# EAGLE schematic Schematic (EAGLE 9.6.2)
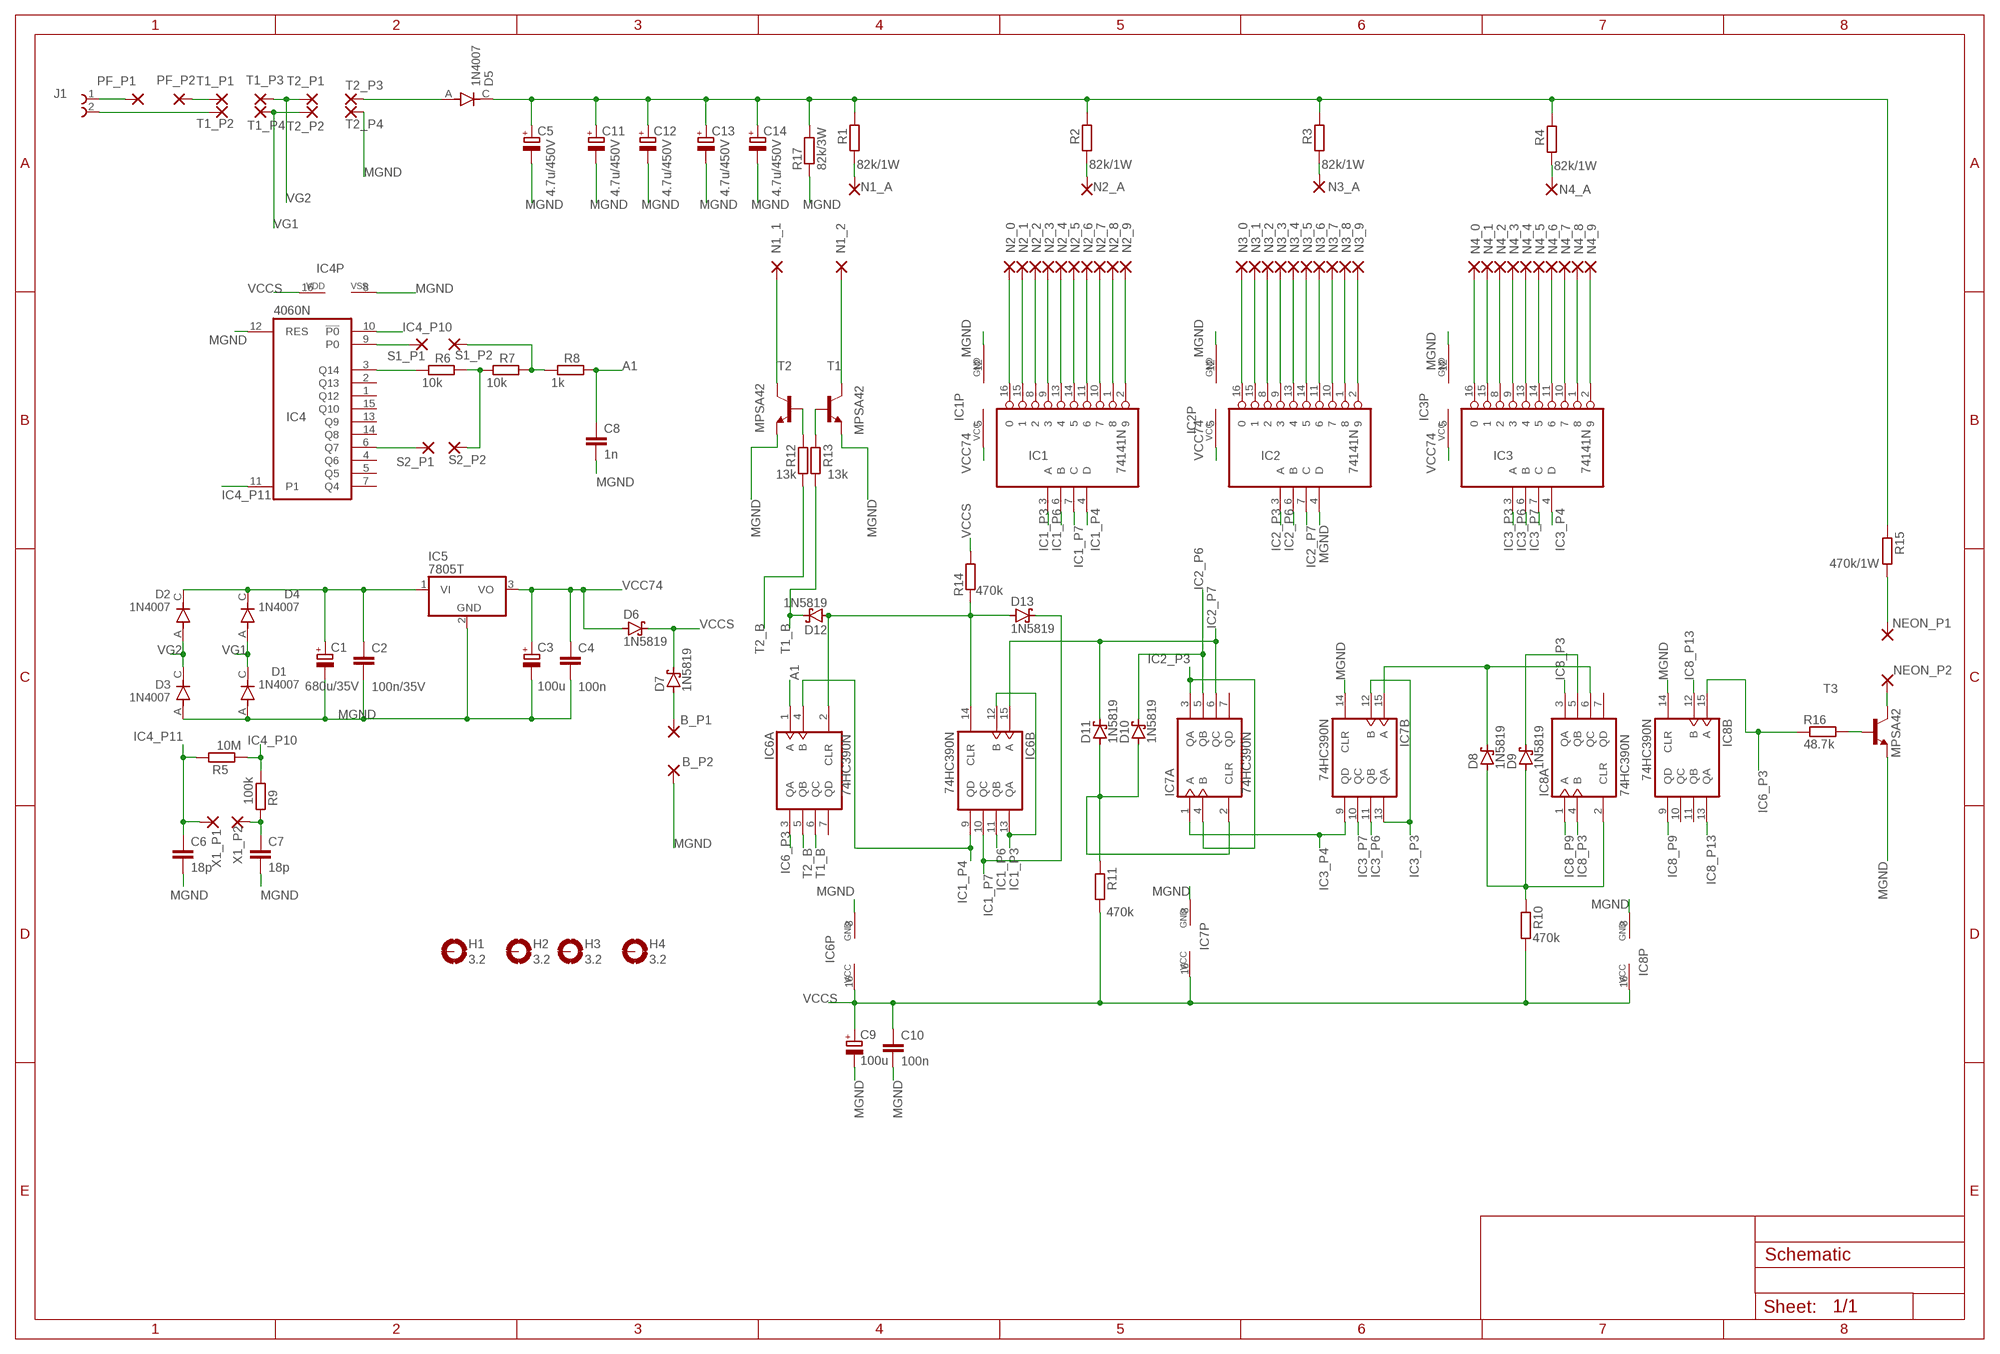
[diagram p0: schematic, sheet 1]

## Parts
B_P1  3,81/1,4  [3,81/1,4]
B_P2  3,81/1,4  [3,81/1,4]
C1  680u/35V  CPOL-EUE5-10.5  [E5-10,5]
C2  100n/35V  C-EU025-024X044  [C025-024X044]
C3  100u  CPOL-EUE2-4  [E2-4]
C4  100n  C-EU025-024X044  [C025-024X044]
C5  4.7u/450V  CPOL-EUE5-8.5  [E5-8,5]
C6  18p  C-EU025-024X044  [C025-024X044]
C7  18p  C-EU025-024X044  [C025-024X044]
C8  1n  C-EU025-024X044  [C025-024X044]
C9  100u  CPOL-EUE2-4  [E2-4]
C10  100n  C-EU025-024X044  [C025-024X044]
C11  4.7u/450V  CPOL-EUE5-8.5  [E5-8,5]
C12  4.7u/450V  CPOL-EUE5-8.5  [E5-8,5]
C13  4.7u/450V  CPOL-EUE5-8.5  [E5-8,5]
C14  4.7u/450V  CPOL-EUE5-8.5  [E5-8,5]
D1  1N4007  [DIOAD1060W80L520D270]
D2  1N4007  [DIOAD1060W80L520D270]
D3  1N4007  [DIOAD1060W80L520D270]
D4  1N4007  [DIOAD1060W80L520D270]
D5  1N4007  [DIOAD1060W80L520D270]
D6  1N5819  1N5819-B  [DO41-7.6]
D7  1N5819  1N5819-B  [DO41-7.6]
D8  1N5819  1N5819-B  [DO41-7.6]
D9  1N5819  1N5819-B  [DO41-7.6]
D10  1N5819  1N5819-B  [DO41-7.6]
D11  1N5819  1N5819-B  [DO41-7.6]
D12  1N5819  1N5819-B  [DO41-7.6]
D13  1N5819  1N5819-B  [DO41-7.6]
H1  3.2  MOUNT-PAD-ROUND3.2  [3,2-PAD]
H2  3.2  MOUNT-PAD-ROUND3.2  [3,2-PAD]
H3  3.2  MOUNT-PAD-ROUND3.2  [3,2-PAD]
H4  3.2  MOUNT-PAD-ROUND3.2  [3,2-PAD]
IC1  74141N  [DIL16]
IC2  74141N  [DIL16]
IC3  74141N  [DIL16]
IC4  4060N  [DIL16]
IC5  7805T  [TO220H]
IC6  74HC390N  [DIL16]
IC7  74HC390N  [DIL16]
IC8  74HC390N  [DIL16]
J1  691216910002  [691216910002]
N1_1  3,81/1,4  [3,81/1,4]
N1_2  3,81/1,4  [3,81/1,4]
N1_A  3,81/1,4  [3,81/1,4]
N2_0  3,81/1,4  [3,81/1,4]
N2_1  3,81/1,4  [3,81/1,4]
N2_2  3,81/1,4  [3,81/1,4]
N2_3  3,81/1,4  [3,81/1,4]
N2_4  3,81/1,4  [3,81/1,4]
N2_5  3,81/1,4  [3,81/1,4]
N2_6  3,81/1,4  [3,81/1,4]
N2_7  3,81/1,4  [3,81/1,4]
N2_8  3,81/1,4  [3,81/1,4]
N2_9  3,81/1,4  [3,81/1,4]
N2_A  3,81/1,4  [3,81/1,4]
N3_0  3,81/1,4  [3,81/1,4]
N3_1  3,81/1,4  [3,81/1,4]
N3_2  3,81/1,4  [3,81/1,4]
N3_3  3,81/1,4  [3,81/1,4]
N3_4  3,81/1,4  [3,81/1,4]
N3_5  3,81/1,4  [3,81/1,4]
N3_6  3,81/1,4  [3,81/1,4]
N3_7  3,81/1,4  [3,81/1,4]
N3_8  3,81/1,4  [3,81/1,4]
N3_9  3,81/1,4  [3,81/1,4]
N3_A  3,81/1,4  [3,81/1,4]
N4_0  3,81/1,4  [3,81/1,4]
N4_1  3,81/1,4  [3,81/1,4]
N4_2  3,81/1,4  [3,81/1,4]
N4_3  3,81/1,4  [3,81/1,4]
N4_4  3,81/1,4  [3,81/1,4]
N4_5  3,81/1,4  [3,81/1,4]
N4_6  3,81/1,4  [3,81/1,4]
N4_7  3,81/1,4  [3,81/1,4]
N4_8  3,81/1,4  [3,81/1,4]
N4_9  3,81/1,4  [3,81/1,4]
N4_A  3,81/1,4  [3,81/1,4]
NEON_P1  3,81/1,4  [3,81/1,4]
NEON_P2  3,81/1,4  [3,81/1,4]
PF_P1  3,81/1,4  [3,81/1,4]
PF_P2  3,81/1,4  [3,81/1,4]
R1  82k/1W  R-EU_0207/10  [0207/10]
R2  82k/1W  R-EU_0207/10  [0207/10]
R3  82k/1W  R-EU_0207/10  [0207/10]
R4  82k/1W  R-EU_0207/10  [0207/10]
R5  10M  R-EU_0207/10  [0207/10]
R6  10k  R-EU_0207/10  [0207/10]
R7  10k  R-EU_0207/10  [0207/10]
R8  1k  R-EU_0207/10  [0207/10]
R9  100k  R-EU_0207/10  [0207/10]
R10  470k  R-EU_0207/10  [0207/10]
R11  470k  R-EU_0207/10  [0207/10]
R12  13k  R-EU_0207/10  [0207/10]
R13  13k  R-EU_0207/10  [0207/10]
R14  470k  R-EU_0207/10  [0207/10]
R15  470k/1W  R-EU_0207/10  [0207/10]
R16  48.7k  R-EU_0207/10  [0207/10]
R17  82k/3W  R-EU_0411/12  [0411/12]
S1_P1  3,81/1,4  [3,81/1,4]
S1_P2  3,81/1,4  [3,81/1,4]
S2_P1  3,81/1,4  [3,81/1,4]
S2_P2  3,81/1,4  [3,81/1,4]
T1  MPSA42  MPSA06-NPN-TO92-EBC  [TO92-EBC]
T1_P1  3,81/1,4  [3,81/1,4]
T1_P2  3,81/1,4  [3,81/1,4]
T1_P3  3,81/1,4  [3,81/1,4]
T1_P4  3,81/1,4  [3,81/1,4]
T2  MPSA42  MPSA06-NPN-TO92-EBC  [TO92-EBC]
T2_P1  3,81/1,4  [3,81/1,4]
T2_P2  3,81/1,4  [3,81/1,4]
T2_P3  3,81/1,4  [3,81/1,4]
T2_P4  3,81/1,4  [3,81/1,4]
T3  MPSA42  MPSA06-NPN-TO92-EBC  [TO92-EBC]
X1_P1  1,6/0,8  [1,6/0,8]
X1_P2  1,6/0,8  [1,6/0,8]

## Nets
0_1: IC1.16 N2_0.1(P)
0_2: IC2.16 N3_0.1(P)
0_3: IC3.16 N4_0.1(P)
A1: C8.1 IC6.1(A:A) R8.2
IC1_P3: IC1.3(A) IC6.12(B:B) IC6.13(B:QA)
IC1_P4: IC1.4(D) IC6.4(A:B) IC6.9(B:QD)
IC1_P6: IC1.6(B) IC6.11(B:QB)
IC1_P7: D13.C IC1.7(C) IC6.10(B:QC)
IC2_P3: IC2.3(A) IC7.3(A:QA) IC7.4(A:B)
IC2_P6: D10.C IC2.6(B) IC7.5(A:QB)
IC2_P7: D11.C IC2.7(C) IC6.15(B:A) IC7.6(A:QC)
IC3_P3: IC3.3(A) IC7.12(B:B) IC7.13(B:QA)
IC3_P4: IC3.4(D) IC7.1(A:A) IC7.9(B:QD)
IC3_P6: IC3.6(B) IC7.11(B:QB)
IC3_P7: IC3.7(C) IC7.10(B:QC)
IC4_P10: IC4.10(!P0) R5.1 R9.1
IC4_P11: C6.1 IC4.11(P1) R5.2 X1_P1.1(P)
IC6_P3: IC6.3(A:QA) IC8.15(B:A) R16.1
IC8_P3: IC8.3(A:QA) IC8.4(A:B)
IC8_P9: IC8.1(A:A) IC8.9(B:QD)
IC8_P13: IC8.12(B:B) IC8.13(B:QA)
MGND: B_P2.1(P) C1.- C2.2 C3.- C4.2 C5.- C6.2 C7.2 C8.2 C9.- C10.2 C11.- C12.- C13.- C14.- D1.A D3.A IC1.12(GND) IC2.4(D) IC2.12(GND) IC3.12(GND) IC4.8(VSS) IC4.12(RES) IC5.2(GND) IC6.8(P:GND) IC7.8(P:GND) IC7.14(B:CLR) IC8.8(P:GND) IC8.14(B:CLR) R17.1 T1.E T2.E T2_P4.1(P) T3.E
N$1 [HV]: J1.1 PF_P1.1(P)
N$2 [HV]: J1.2 T1_P2.1(P)
N$3 [HV]: D5.A T2_P3.1(P)
N$4 [HV]: C5.+ C11.+ C12.+ C13.+ C14.+ D5.C R1.2 R2.2 R3.2 R4.2 R15.1 R17.2
N$5 [HV]: N2_A.1(P) R2.1
N$6 [HV]: N3_A.1(P) R3.1
N$7 [HV]: N4_A.1(P) R4.1
N$8 [HV]: N1_A.1(P) R1.1
N$9: IC4.9(P0) S1_P1.1(P)
N$10: IC4.6(Q7) S2_P1.1(P)
N$11: IC4.3(Q14) R6.1
N$12: R6.2 R7.1 S2_P2.1(P)
N$13: R7.2 R8.1 S1_P2.1(P)
N$14: D12.A D13.A IC6.2(A:CLR) IC6.14(B:CLR) R14.1
N$15: IC1.15 N2_1.1(P)
N$16: C1.+ C2.1 D2.C D4.C IC5.1(VI)
N$17: B_P1.1(P) D7.A
N$18: IC1.8 N2_2.1(P)
N$19: IC1.9 N2_3.1(P)
N$20: IC1.13 N2_4.1(P)
N$21: IC1.14 N2_5.1(P)
N$22: IC1.11 N2_6.1(P)
N$23: IC1.10 N2_7.1(P)
N$24: IC1.1 N2_8.1(P)
N$25: IC1.2 N2_9.1(P)
N$26: IC2.15 N3_1.1(P)
N$27: IC2.8 N3_2.1(P)
N$28: IC2.9 N3_3.1(P)
N$29: IC2.13 N3_4.1(P)
N$30: IC2.14 N3_5.1(P)
N$31: IC2.11 N3_6.1(P)
N$32: IC2.10 N3_7.1(P)
N$33: IC2.1 N3_8.1(P)
N$34: IC2.2 N3_9.1(P)
N$35: IC3.15 N4_1.1(P)
N$36: IC3.8 N4_2.1(P)
N$37: IC3.9 N4_3.1(P)
N$38: IC3.13 N4_4.1(P)
N$39: IC3.14 N4_5.1(P)
N$40: IC3.11 N4_6.1(P)
N$41: IC3.10 N4_7.1(P)
N$42: IC3.1 N4_8.1(P)
N$43: IC3.2 N4_9.1(P)
N$44: C7.1 R9.2 X1_P2.1(P)
N$45: R13.2 T2.B
N$46: D8.A D9.A IC8.2(A:CLR) R10.1
N$47: D8.C IC7.15(B:A) IC8.6(A:QC)
N$48: D9.C IC8.5(A:QB)
N$49: D10.A D11.A IC7.2(A:CLR) R11.1
N$50: N1_1.1(P) T1.C
N$51: N1_2.1(P) T2.C
N$52 [HV]: NEON_P1.1(P) R15.2
N$53 [HV]: NEON_P2.1(P) T3.C
N$54: R16.2 T3.B
N$55: R12.2 T1.B
N$56 [HV]: PF_P2.1(P) T1_P1.1(P)
T1_B: D12.C IC6.6(A:QC) R13.1
T2_B: IC6.5(A:QB) R12.1
VCC74: C3.+ C4.1 D6.A IC1.5(VCC) IC2.5(VCC) IC3.5(VCC) IC5.3(VO)
VCCS: C9.+ C10.1 D6.C D7.C IC4.16(VDD) IC6.16(P:VCC) IC7.16(P:VCC) IC8.16(P:VCC) R10.2 R11.2 R14.2
VG1 [HV]: D1.C D4.A T1_P4.1(P) T2_P2.1(P)
VG2 [HV]: D2.A D3.C T1_P3.1(P) T2_P1.1(P)
Unconnected: H1.B3,2(MOUNT) H2.B3,2(MOUNT) H3.B3,2(MOUNT) H4.B3,2(MOUNT) IC4.1(Q12) IC4.2(Q13) IC4.4(Q6) IC4.5(Q5) IC4.7(Q4) IC4.13(Q9) IC4.14(Q8) IC4.15(Q10) IC6.7(A:QD) IC7.7(A:QD) IC8.7(A:QD) IC8.10(B:QC) IC8.11(B:QB)

## Library data of the parts
B_P1 B_P2 N1_1 N1_2 N1_A N2_0 N2_1-N2_9 N2_A N3_0 N3_1-N3_9 N3_A N4_0 N4_1-N4_9 N4_A NEON_P1 NEON_P2 PF_P1 PF_P2 S1_P1 S1_P2 S2_P1 S2_P2 T1_P1-T1_P4 T2_P1-T2_P4 = wirepad:3,81/1,4: THROUGH-HOLE PAD
C1 C3 C5 C9 C11-C14 = rcl:CPOL-EU: POLARIZED CAPACITOR, European symbol; SPICEPREFIX: C
C2 C4 C6-C8 C10 = rcl:C-EU: CAPACITOR, European symbol; SPICEPREFIX: C
D1-D5 = 1N4007:1N4007: Diode Switching 1KV 1A 2-Pin DO-41 Check availability <https://pricing.snapeda.com/parts/1N4007/Diotec%20Semiconductor/view-part?ref=eda>; AVAILABILITY: In Stock; DESCRIPTION: Diode Standard 1000 V 1A Through Hole DO-41/DO-204AC; MF: Diotec Semiconductor; MP: 1N4007; PACKAGE: DO-41-2 Diotec; PRICE: None; PURCHASE-URL: https://pricing.snapeda.com/search/part/1N4007/?ref=eda
D6-D13 = diode:1N581*: 1.0A SCHOTTKY BARRIER RECTIFIER Source: http://www.diodes.com/datasheets/ds23001.pdf
H1-H4 = holes:MOUNT-PAD-ROUND: MOUNTING PAD, round
IC1-IC3 = 74xx-us:74*141: BCD to decimal DECODER/DRIVER
IC4 = 40xx:4060: 14-stage binary/ripple COUNTER
IC5 = linear:78*: Positive VOLTAGE REGULATOR Source: http://cache.national.com/ds/LM/LM78L05.pdf http://www.fairchildsemi.com/ds/LM/LM7805.pdf
IC6-IC8 = 74xx-eu:74*390: Dual 4-bit decade and binary COUNTER
J1 = ak750:691216910002: WR-TBL2 SERIE 2169 - 7.50 MM - HORIZONTAL CABLE ENTRY WITH RISING CAGE CLAMP - 2 pins <http://katalog.we-online.de/media/thumbs2/eican/thb_Con_TBL_Screw_RisingClamp_7.50_6912169100xx_pf2.jpg> Details see: http://katalog.we-online.de/en/em/TBL_7_50_2169_HORIZONTAL_ENTRY_MODULAR_69121691000x Created on 2015-07-10 2015 (C) Wurth Elektronik Check availability <https://pricing.snapeda.com/parts/691216910002/Wurth%20Electronics/view-part?ref=eda>; AVAILABILITY: In Stock; DESCRIPTION: 2 Position Wire to Board Terminal Block Horizontal with Board 0.295 (7.50mm) Through Hole; MF: Wurth Electronics; MP: 691216910002; PACKAGE: None; PRICE: None
R1-R17 = rcl:R-EU_: RESISTOR, European symbol; SPICEPREFIX: R
T1-T3 = transistor:*-NPN-: NPN Transistror BF959 corrected 2008.03.06
X1_P1 X1_P2 = wirepad:1,6/0,8: THROUGH-HOLE PAD

## Net classes
1 HV: clearance 2 mm